# Altium project inwall_wifi_int.PrjPcb
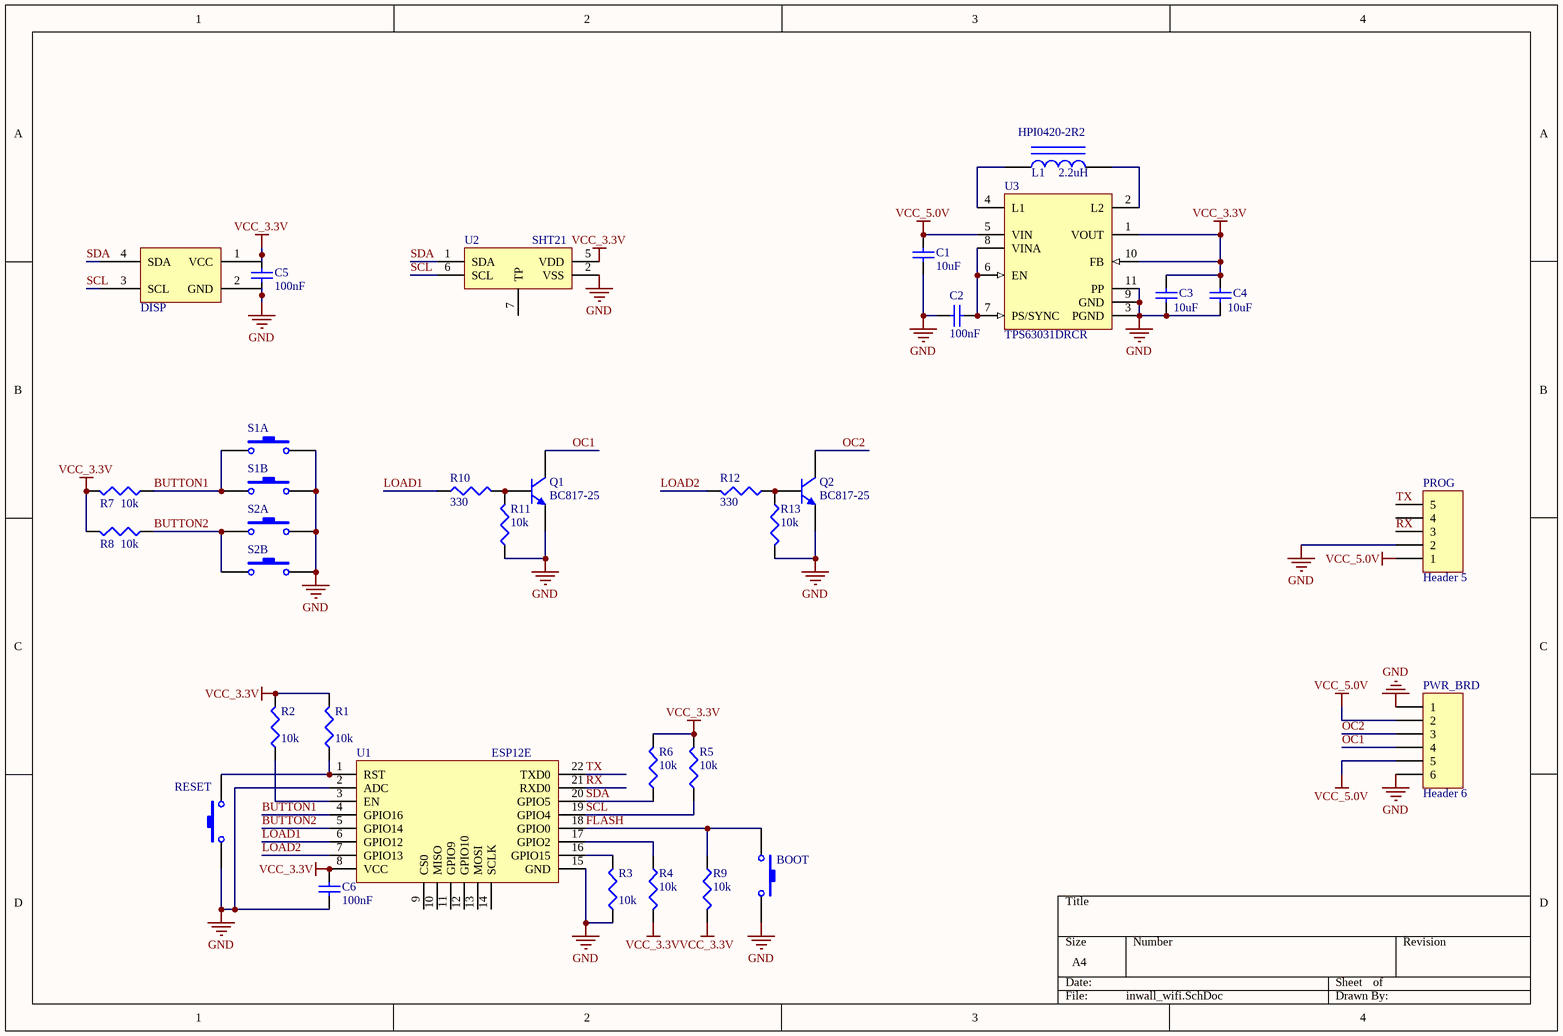
[diagram p0: inwall_wifi.SchDoc]
2 sheets, 50 parts. Net scope: global (net labels, ports and power ports of the same name join across sheets).
Sheets:
  inwall_wifi.SchDoc
  inwall_wifi_psu.SchDoc

## Sheet inwall_wifi.SchDoc
size A4

### Parts
(Parts that share a designator on the sheet are numbered #1, #2 ... from top to bottom, then left to right.)
BOOT  SW-PB  [B3U-1000P(M)]  (value not drawn)
C1#1  value 10uF  [1608[0603]]  (hidden comment: Cap Semi)
C2#1  value 100nF  [1608[0603]]  (hidden comment: Cap Semi)
C3#1  value 10uF  [1608[0603]]  (hidden comment: Cap Semi)
C4  value 10uF  [1608[0603]]  (hidden comment: Cap Semi)
C5  value 100nF  [1608[0603]]  (hidden comment: Cap Semi)
C6  value 100nF  [1608[0603]]  (hidden comment: Cap Semi)
DISP  0.96'' OLED I2C  [OLED_I2C]  (value not drawn)
L1#1  HPI0420-2R2  value 2.2uH  [HPI 0420]
PROG  Header 5  [HDR1X5]
PWR_BRD  Header 6  [HDR1X6]
Q1  BC817-25  [SOT-23A_N]
Q2  BC817-25  [SOT-23A_N]
R1  value 10k  [J1-0603]  (hidden comment: Res3)
R2  value 10k  [J1-0603]  (hidden comment: Res3)
R3  value 10k  [J1-0603]  (hidden comment: Res3)
R4  value 10k  [J1-0603]  (hidden comment: Res3)
R5  value 10k  [J1-0603]  (hidden comment: Res3)
R6  value 10k  [J1-0603]  (hidden comment: Res3)
R7  value 10k  [J1-0603]  (hidden comment: Res3)
R8  value 10k  [J1-0603]  (hidden comment: Res3)
R9  value 10k  [J1-0603]  (hidden comment: Res3)
R10  value 330  [J1-0603]  (hidden comment: Res3)
R11  value 10k  [J1-0603]  (hidden comment: Res3)
R12  value 330  [J1-0603]  (hidden comment: Res3)
R13  value 10k  [J1-0603]  (hidden comment: Res3)
RESET  SW-PB  [B3U-1000P(M)]  (value not drawn)
S1A  SW-PB  [B3AL]  (value not drawn)
S1B  SW-PB  [B3AL]  (value not drawn)
S2A  SW-PB  [B3AL]  (value not drawn)
S2B  SW-PB  [B3AL]  (value not drawn)
U1#1  ESP12E  [ESP12E]
U2  SHT21  [SON100P300X120_HS-7N]
U3  TPS63031DRCR  [DRC10-2400X1650TP]

### Nets
GND: BOOT.2 C1#1.2 C2#1.2 C3#1.1 C4.1 C5.2 C6.2 DISP.2(GND) PROG.2 PWR_BRD.1 PWR_BRD.6 Q1.2(E) Q2.2(E) R3.1 R11.1 R13.2 RESET.1 S1A.2 S1B.2 S2A.2 S2B.2 U1#1.2(ADC) U1#1.15(GND) U2.2(VSS) U3.3(PGND) U3.9(GND) U3.11(PP)
VCC_3.3V: C3#1.2 C4.2 C5.1 C6.1 DISP.1(VCC) R1.2 R2.2 R4.2 R5.2 R6.2 R7.2 R8.2 R9.2 U1#1.8(VCC) U2.5(VDD) U3.1(VOUT) U3.10(FB)
VCC_5.0V: C1#1.1 PROG.1 PWR_BRD.2 PWR_BRD.5 U3.5(VIN)
BUTTON1: R7.1 S1A.1 S1B.1 U1#1.4(GPIO16)
BUTTON2: R8.1 S2A.1 S2B.1 U1#1.5(GPIO14)
FLASH: BOOT.1 R9.1 U1#1.18(GPIO0)
LOAD1: R10.1 U1#1.6(GPIO12)
LOAD2: R12.2 U1#1.7(GPIO13)
OC1: PWR_BRD.4 Q1.3(C)
OC2: PWR_BRD.3 Q2.3(C)
RX: PROG.3 U1#1.21(RXD0)
SCL: DISP.3(SCL) R5.1 U1#1.19(GPIO4) U2.6(SCL)
SDA: DISP.4(SDA) R6.1 U1#1.20(GPIO5) U2.1(SDA)
TX: PROG.5 U1#1.22(TXD0)
NetC2#1_1: C2#1.1 U3.6(EN) U3.7(PS/SYNC) U3.8(VINA)
NetL1#1_1: L1#1.1 U3.4(L1)
NetL1#1_2: L1#1.2 U3.2(L2)
NetQ1_1: Q1.1(B) R10.2 R11.2
NetQ2_1: Q2.1(B) R12.1 R13.1
NetR1_1: R1.1 RESET.2 U1#1.1(RST)
NetR2_1: R2.1 U1#1.3(EN)
NetR3_2: R3.2 U1#1.16(GPIO15)
NetR4_1: R4.1 U1#1.17(GPIO2)

Not connected (* = marked no-connect by the designer): PROG 4; U1#1 9(CS0) 10(MISO) 11(GPIO9) 12(GPIO10) 13(MOSI) 14(SCLK); U2 7(TP)

### Library data of the parts
BOOT RESET S1A S1B S2A S2B = SW-PB: Switch; Published: 24-Mar-1999; LatestRevisionDate: 17-Jul-2002; LatestRevisionNote: Re-released for DXP Platform.; PackageReference: SPST-2; Publisher: Altium Limited; PackageDescription: Switch; 2 Leads; Supplier 1: Farnell; Supplier 2: Farnell
  BOOT RESET: Supplier Part Number 1: 2500851; Supplier Part Number 2: 1333652
  S1A S1B S2A S2B: Supplier Part Number 1: 1908276RL; Supplier Part Number 2: 1908275; Supplier 3: Farnell; Supplier Part Number 3: 1908272; Supplier 4: Farnell; Supplier Part Number 4: 1908274
C1#1 C2#1 C3#1 C4-C6 = Cap Semi: Capacitor (Semiconductor SIM Model); Published: 8-Jun-2000; LatestRevisionDate: 29-May-2009; LatestRevisionNote: IPC-7351 Footprint Added.; PackageReference: C1206; Publisher: Altium Limited; PackageDescription: Chip Capacitor
DISP = OLED_I2C: Supplier 1: TME; Supplier Part Number 1: REX012864MXPP3N0
L1#1 = Inductor Iron: Magnetic-Core Inductor; Published: 24-Mar-1999; LatestRevisionDate: 17-Jul-2002; LatestRevisionNote: Re-released for DXP Platform.; PackageReference: AXIAL-0.9; Publisher: Altium Limited; PackageDescription: Axial Device, Thru-Hole; 2 Leads; 0.9 in Pin Spacing; Supplier 1: TME; Supplier Part Number 1: HPI0420-2R2
PROG = Header 5: Header, 5-Pin; LatestRevisionDate: 17-Jul-2002; LatestRevisionNote: Re-released for DXP Platform.; Publisher: Altium Limited
PWR_BRD = Header 6: Header, 6-Pin; LatestRevisionDate: 17-Jul-2002; LatestRevisionNote: Re-released for DXP Platform.; Publisher: Altium Limited
Q1 Q2 = BC817-25: NPN General Purpose Amplifier; Published: 8-Jun-2000; LatestRevisionDate: 20-Nov-2009; LatestRevisionNote: IPC-7351 Footprint Added.; DatasheetVersion: 1997; PackageVersion: Sep-1998; PackageReference: SOT-23A; Publisher: Altium Limited; PackageDescription: 3-Pin SOT-23 Package 0.95 mm Pitch, 2.3 mm Lead Span; ComponentLink1Description: Manufacturer Link; ComponentLink1URL: http://www.fairchildsemi.com/; ComponentLink2Description: Discontinuation Notice; ComponentLink2URL: http://www.fairchildsemi.com/obsolete/obs.jsp
R1-R13 = Res3: Resistor; Published: 8-Jun-2000; LatestRevisionDate: 29-May-2009; LatestRevisionNote: IPC-7351 Footprint Added.; PackageReference: J1-0603; Publisher: Altium Limited; PackageDescription: Chip Resistor
U2 = SHT21: SHT21 H/T sensor
U3 = TPS63001DRCR: Buck-Boost Voltage Converter with 1.8 to 5.5 V Input and 3.3 V Output, -40 to 85 degC, 10-Pin SON (DRC), Green (RoHS & no Sb/Br); Manufacturer: Texas Instruments; Dynamic Voltage Scaling: TRUE; Iout(Max)(A): 1.2; Iq(Typ)(mA): 0.03; Preset Vout(V): 3.3; Regulated Outputs(#): 1; SubFamily: Buck-Boost Regulator; Switching Frequency(Max)(kHz): 1500; Vin(Max)(V): 5.5; Vin(Min)(V): 1.8; DatasheetVersion: SLVS520B; PackageVersion: revL, Sep-2011; PackageReference: DRC10-2400X1650TP; PackageDescription: 10-Pin Plastic Small Outline No-Lead, 3 x 3 x 1 mm Body, 0.5 mm Pitch, Exposed Pad; Supplier 1: Digi-Key; Supplier Part Number 1: 296-19643-2-ND; Supplier 2: Digi-Key; Supplier Part Number 2: 296-19643-1-ND; Supplier 3: Digi-Key; Supplier Part Number 3: 296-19643-6-ND; Supplier 4: Farnell; Supplier Part Number 4: 1412595; Supplier 5: Newark; Supplier Part Number 5: 85K1711; Supplier 6: Mouser; Supplier Part Number 6: 595-TPS63001DRCR; Eco-Plan: Green (RoHS & no Sb/Br); Synchronous Rectification: TRUE; Topology: Buck-Boost; Vout(Max)(V): 3.3; Vout(Min)(V): 3.3; Mounting Technology: Surface Mount; PartNumber: TPS63001DRCR; ComponentLink1Description: Datasheet; ComponentLink1URL: http://www.ti.com/general/docs/lit/getliterature.tsp?genericPartNumber=TPS63001&fileType=pdf; ComponentLink2Description: Package Specification; ComponentLink2URL: http://www.ti.com/litv/pdf/mpds117k; Supplier 7: TME; Supplier Part Number 7: TPS63031DSKT

## Sheet inwall_wifi_psu.SchDoc
size A4
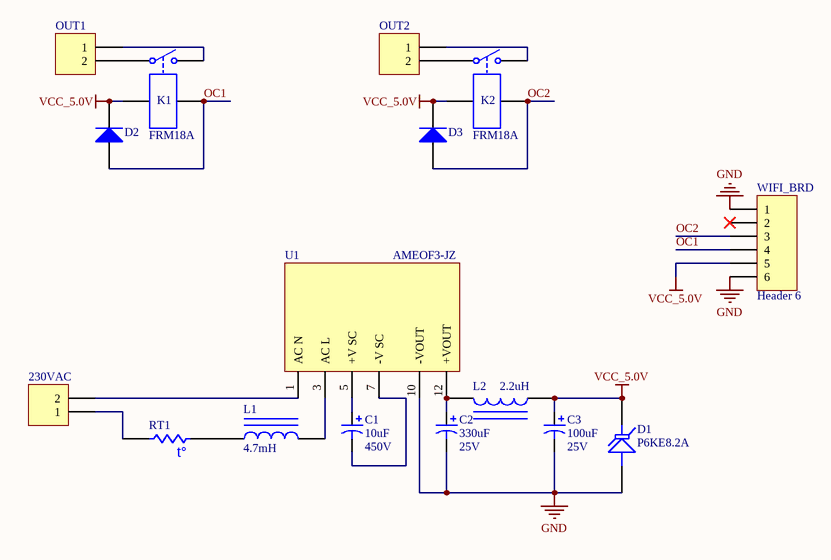
[diagram p1: inwall_wifi_psu.SchDoc]

### Parts
(Parts that share a designator on the sheet are numbered #1, #2 ... from top to bottom, then left to right.)
230VAC  Header 2  [DG126-5.0-2P14]  (value not drawn)
C1#2  value 10uF  Voltage: 450V  [Capacitor Polarised 10x20x5mm]  (hidden comment: UCY2W100MPD)
C2#2  value 330uF  Voltage: 25V  [Capacitor Polarised 10x12.5x5mm]  (hidden comment: UVZ1E331MPD)
C3#2  value 100uF  Voltage: 25V  [Capacitor Polarised 6.3x11x2.5mm]  (hidden comment: UVZ1E101MED)
D1  P6KE8.2A  [Vertically mounted diode 3x6.3mm]
D2  Diode 1N4148  [DO-35]  (value not drawn)
D3  Diode 1N4148  [DO-35]  (value not drawn)
K1  FRM18A  [FRM18A]
K2  FRM18A  [FRM18A]
L1#2  value 4.7mH  [Inductor 11.5x11.5x5mm]  (hidden comment: COIL0912-4.7)
L2  value 2.2uH  [Axial Inductor 3x8mm vertically]  (hidden comment: DLA2.2-N)
OUT1  Header 2  [DG126-5.0-2P14]  (value not drawn)
OUT2  Header 2  [DG126-5.0-2P14]  (value not drawn)
RT1  EPCOS B57236S500M  [NTC 11.5x6mm]  (value not drawn)
U1#2  AMEOF3-JZ  [AMEOF3-JZ]
WIFI_BRD  Header 6  [HDR1X6]

### Nets
GND: C2#2.2 C3#2.2 D1.1(A) U1#2.10(-VOUT) WIFI_BRD.1 WIFI_BRD.6
VCC_5.0V: C3#2.1 D1.2(K) D2.2(K) D3.2(K) K1.3 K2.3 L2.1 WIFI_BRD.5
OC1: D2.1(A) K1.4 WIFI_BRD.4
OC2: D3.1(A) K2.4 WIFI_BRD.3
Net230VAC_1: 230VAC.1 RT1.2
Net230VAC_2: 230VAC.2 U1#2.1(AC_N)
NetC1#2_1: C1#2.1 U1#2.5(+V_SC)
NetC1#2_2: C1#2.2 U1#2.7(-V_SC)
NetC2#2_1: C2#2.1 L2.2 U1#2.12(+VOUT)
NetK1_1: K1.1 OUT1.2
NetK1_2: K1.2 OUT1.1
NetK2_1: K2.1 OUT2.2
NetK2_2: K2.2 OUT2.1
NetL1#2_1: L1#2.1 RT1.1
NetL1#2_2: L1#2.2 U1#2.3(AC_L)

Not connected (* = marked no-connect by the designer): WIFI_BRD 2*

### Notes on the sheet
- (in symbol Res Thermal) t°

### Library data of the parts
230VAC OUT1 OUT2 = Header 2: Header, 2-Pin; LatestRevisionDate: 17-Jul-2002; LatestRevisionNote: Re-released for DXP Platform.; Publisher: Altium Limited
C1#2 C2#2 C3#2 = Cap Pol1: Polarized Capacitor (Radial); Published: 8-Jun-2000; LatestRevisionDate: 17-Jul-2002; LatestRevisionNote: Re-released for DXP Platform.; PackageReference: RB7.6-15; Publisher: Altium Limited; PackageDescription: Polarized Capacitor (Radial); 2 Leads; Supplier 1: TME
  C1#2: Supplier Part Number 1: UCY2W100MPD
  C2#2: Supplier Part Number 1: UVZ1E331MPD
  C3#2: Supplier Part Number 1: UVZ1E101MED
D1 = Tranzorb: Transient Voltage Suppression (TVS) Diode; Published: 24-Mar-1999; LatestRevisionDate: 17-Jul-2002; LatestRevisionNote: Re-released for DXP Platform.; PackageReference: DO-7; Publisher: Altium Limited; PackageDescription: Axial Lead Diode; Supplier 1: TME; Supplier Part Number 1: P6KE8.2A-DIO
D2 D3 = Diode 1N4148: High Conductance Fast Diode; Published: 8-Jun-2000; LatestRevisionDate: 17-Jul-2002; LatestRevisionNote: Re-released for DXP Platform.; DatasheetVersion: 1997; PackageReference: DO-35; Publisher: Altium Limited; PackageDescription: Diode, Axial; Body 3.8 x 1.9 mm (LxDia. max), Lead Dia. 0.53 mm (max); Code_JEDEC: DO-204-AH; ComponentLink1Description: Manufacturer Link; ComponentLink1URL: http://www.fairchildsemi.com/; ComponentLink2Description: Datasheet; ComponentLink2URL: http://www.fairchildsemi.com/ds/1N%2F1N4148.pdf
K1 K2 = Relay-SPST: Single-Pole Single-Throw Relay; Published: 24-Mar-1999; LatestRevisionDate: 17-Jul-2002; LatestRevisionNote: Re-released for DXP Platform.; PackageReference: MODULE4; Publisher: Altium Limited; Supplier 1: TME; Supplier Part Number 1: FRM18A-5VDC
L1#2 L2 = Inductor Iron: Magnetic-Core Inductor; Published: 24-Mar-1999; LatestRevisionDate: 17-Jul-2002; LatestRevisionNote: Re-released for DXP Platform.; PackageReference: AXIAL-0.9; Publisher: Altium Limited; PackageDescription: Axial Device, Thru-Hole; 2 Leads; 0.9 in Pin Spacing; Supplier 1: TME
  L1#2: Supplier Part Number 1: COIL1010-4.7; Supplier 2: TME; Supplier Part Number 2: COIL0912-4.7
  L2: Supplier Part Number 1: DLA2.2-N
RT1 = Res Thermal: Thermistor; Published: 24-Mar-1999; LatestRevisionDate: 29-May-2009; LatestRevisionNote: IPC-7351 Footprint Added.; PackageVersion: Mar-2003; PackageReference: 6-0805; Publisher: Altium Limited; PackageDescription: Chip Resistor 0805 Case Size; Code_IPC: RESC2012; Supplier 1: TME; Supplier Part Number 1: B57236S500M
U1#2 = AMEOF3-JZ: 230AC / 3W DC switching PSU; Supplier 1: TME; Supplier Part Number 1: AMEOF3-5SJZ
WIFI_BRD = Header 6: Header, 6-Pin; LatestRevisionDate: 17-Jul-2002; LatestRevisionNote: Re-released for DXP Platform.; Publisher: Altium Limited

## Nets that join several sheets
GND: inwall_wifi (27 pins), inwall_wifi_psu (6 pins)
VCC_5.0V: inwall_wifi (5 pins), inwall_wifi_psu (8 pins)
OC1: inwall_wifi (PWR_BRD.4 Q1.3), inwall_wifi_psu (D2.1 K1.4 WIFI_BRD.4)
OC2: inwall_wifi (PWR_BRD.3 Q2.3), inwall_wifi_psu (D3.1 K2.4 WIFI_BRD.3)